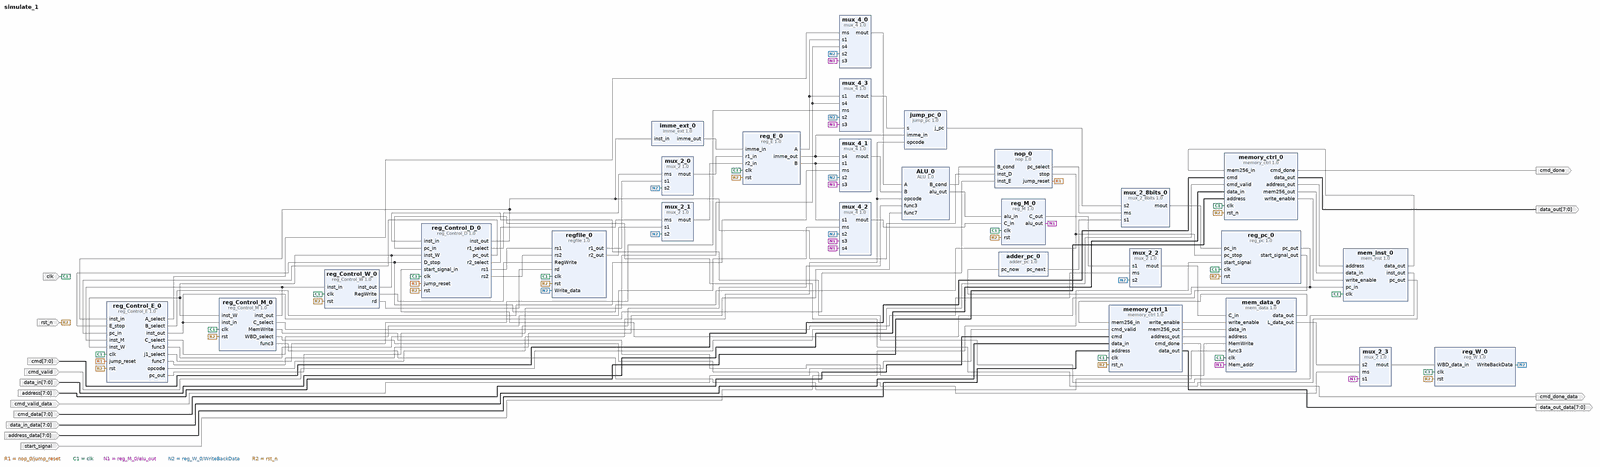
[diagram p0: block diagram of the top level, whole]
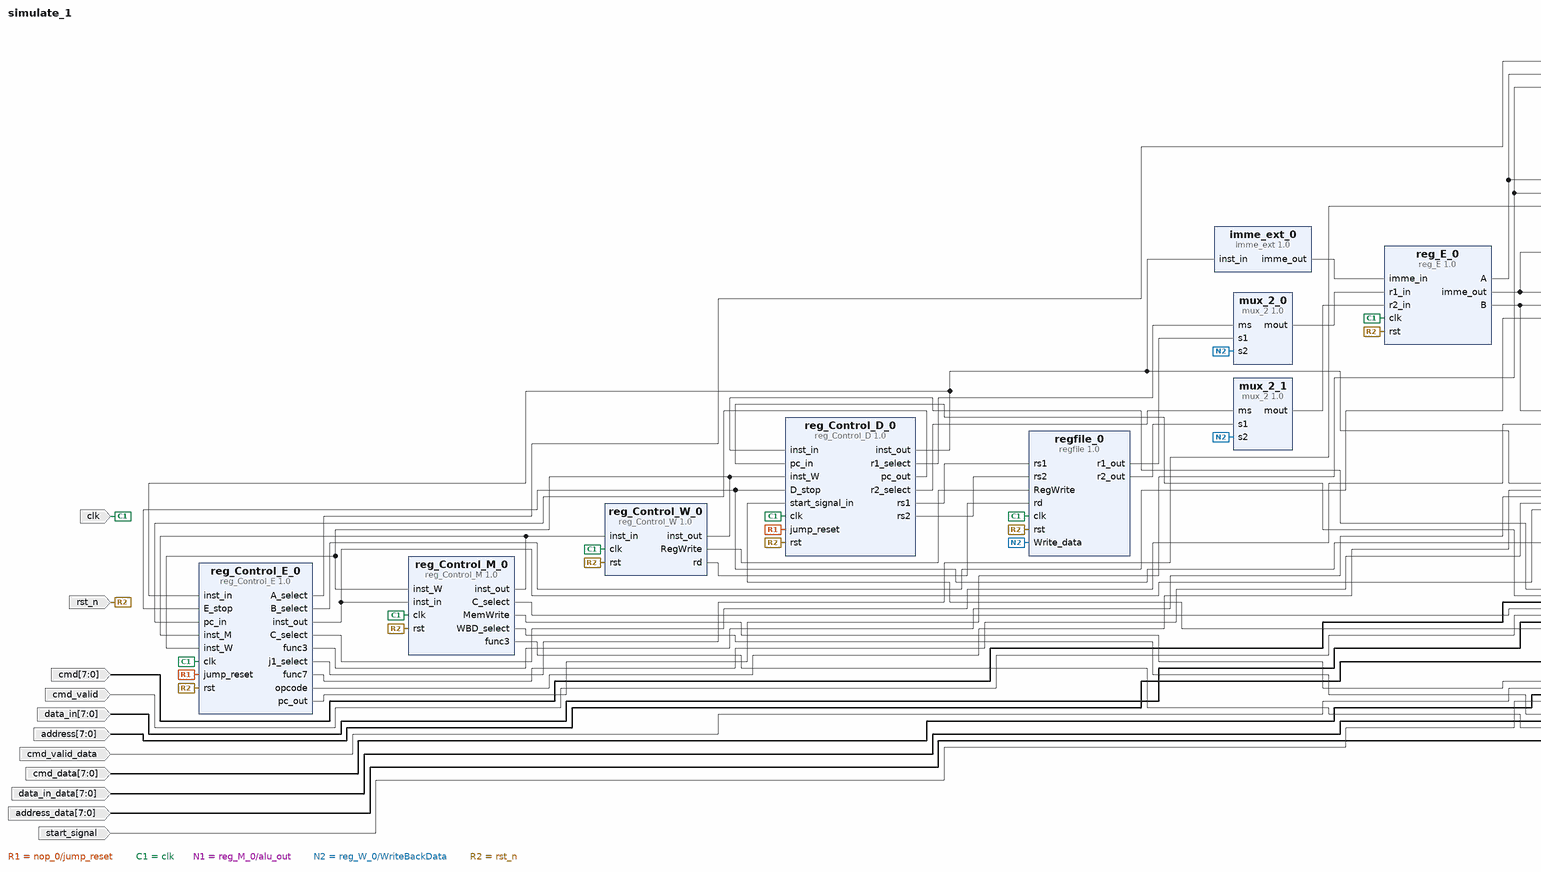
[diagram p1: block diagram of the top level, left part]
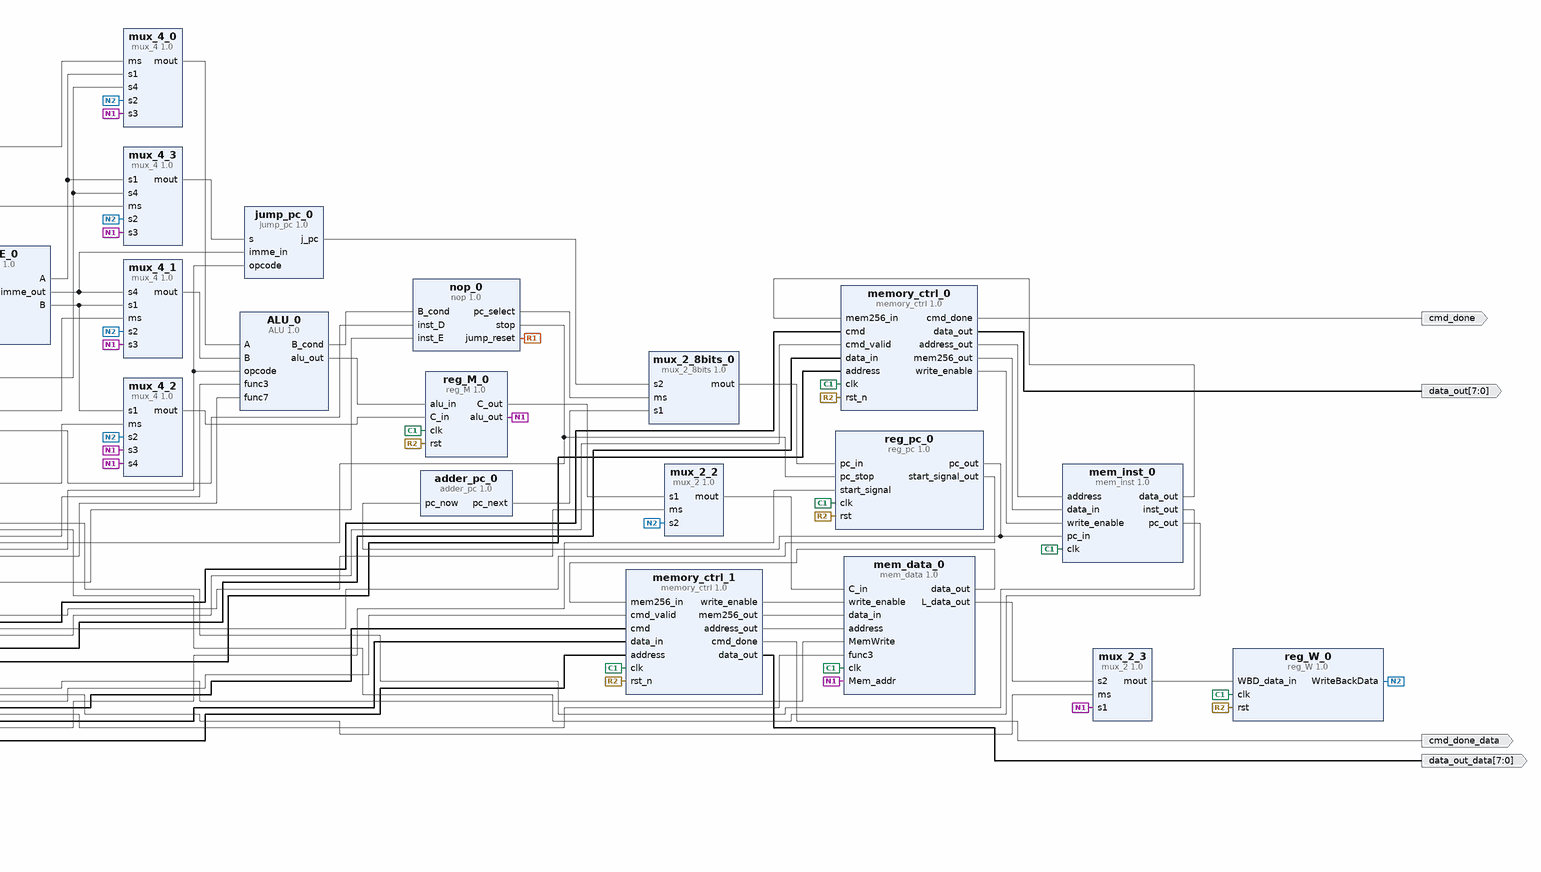
[diagram p2: block diagram of the top level, right part]
# Vivado block design simulate_1, xc7z020clg400-1, Vivado 2018.3
create_bd_design simulate_1

create_bd_port -dir I -type clk clk
create_bd_port -dir I -type rst rst_n
create_bd_port -dir I -from 7 -to 0 cmd
create_bd_port -dir I -from 7 -to 0 address
create_bd_port -dir I cmd_valid
create_bd_port -dir I -from 7 -to 0 data_in
create_bd_port -dir I cmd_valid_data
create_bd_port -dir I -from 7 -to 0 cmd_data
create_bd_port -dir I -from 7 -to 0 data_in_data
create_bd_port -dir I -from 7 -to 0 address_data
create_bd_port -dir I start_signal
create_bd_port -dir O cmd_done
create_bd_port -dir O -from 7 -to 0 data_out
create_bd_port -dir O cmd_done_data
create_bd_port -dir O -from 7 -to 0 data_out_data

create_bd_cell -type ip -vlnv xilinx.com:user:ALU:1.0 ALU_0
create_bd_cell -type ip -vlnv xilinx.com:user:adder_pc:1.0 adder_pc_0
create_bd_cell -type ip -vlnv xilinx.com:user:imme_ext:1.0 imme_ext_0
create_bd_cell -type ip -vlnv xilinx.com:user:jump_pc:1.0 jump_pc_0
create_bd_cell -type ip -vlnv xilinx.com:user:mem_data:1.0 mem_data_0
create_bd_cell -type ip -vlnv xilinx.com:user:mem_inst:1.0 mem_inst_0
create_bd_cell -type ip -vlnv xilinx.com:user:mux_2:1.0 mux_2_0
create_bd_cell -type ip -vlnv xilinx.com:user:mux_2:1.0 mux_2_1
create_bd_cell -type ip -vlnv xilinx.com:user:mux_2:1.0 mux_2_2
create_bd_cell -type ip -vlnv xilinx.com:user:mux_2:1.0 mux_2_3
create_bd_cell -type ip -vlnv xilinx.com:user:mux_2_8bits:1.0 mux_2_8bits_0
create_bd_cell -type ip -vlnv xilinx.com:user:mux_4:1.0 mux_4_0
create_bd_cell -type ip -vlnv xilinx.com:user:mux_4:1.0 mux_4_1
create_bd_cell -type ip -vlnv xilinx.com:user:mux_4:1.0 mux_4_2
create_bd_cell -type ip -vlnv xilinx.com:user:mux_4:1.0 mux_4_3
create_bd_cell -type ip -vlnv xilinx.com:user:nop:1.0 nop_0
create_bd_cell -type ip -vlnv xilinx.com:user:reg_Control_D:1.0 reg_Control_D_0
create_bd_cell -type ip -vlnv xilinx.com:user:reg_Control_E:1.0 reg_Control_E_0
create_bd_cell -type ip -vlnv xilinx.com:user:reg_Control_M:1.0 reg_Control_M_0
create_bd_cell -type ip -vlnv xilinx.com:user:reg_Control_W:1.0 reg_Control_W_0
create_bd_cell -type ip -vlnv xilinx.com:user:reg_E:1.0 reg_E_0
create_bd_cell -type ip -vlnv xilinx.com:user:reg_M:1.0 reg_M_0
create_bd_cell -type ip -vlnv xilinx.com:user:reg_W:1.0 reg_W_0
create_bd_cell -type ip -vlnv xilinx.com:user:reg_pc:1.0 reg_pc_0
create_bd_cell -type ip -vlnv xilinx.com:user:regfile:1.0 regfile_0
create_bd_cell -type ip -vlnv xilinx.com:user:memory_ctrl:1.0 memory_ctrl_0
create_bd_cell -type ip -vlnv xilinx.com:user:memory_ctrl:1.0 memory_ctrl_1

# ---- connections ----

connect_bd_net [get_bd_pins ALU_0/B_cond] [get_bd_pins nop_0/B_cond]
connect_bd_net [get_bd_pins ALU_0/alu_out] [get_bd_pins reg_M_0/alu_in]
connect_bd_net [get_bd_pins adder_pc_0/pc_next] [get_bd_pins mux_2_8bits_0/s1]
connect_bd_net [get_bd_pins imme_ext_0/imme_out] [get_bd_pins reg_E_0/imme_in]
connect_bd_net [get_bd_pins jump_pc_0/j_pc] [get_bd_pins mux_2_8bits_0/s2]
connect_bd_net [get_bd_pins mem_data_0/L_data_out] [get_bd_pins mux_2_3/s2]
connect_bd_net [get_bd_pins mem_inst_0/inst_out] [get_bd_pins reg_Control_D_0/inst_in]
connect_bd_net [get_bd_pins mem_inst_0/pc_out] [get_bd_pins reg_Control_D_0/pc_in]
connect_bd_net [get_bd_pins mux_2_0/mout] [get_bd_pins reg_E_0/r1_in]
connect_bd_net [get_bd_pins mux_2_1/mout] [get_bd_pins reg_E_0/r2_in]
connect_bd_net [get_bd_pins mux_2_2/mout] [get_bd_pins mem_data_0/C_in]
connect_bd_net [get_bd_pins mux_2_3/mout] [get_bd_pins reg_W_0/WBD_data_in]
connect_bd_net [get_bd_pins mux_2_8bits_0/mout] [get_bd_pins reg_pc_0/pc_in]
connect_bd_net [get_bd_pins mux_4_0/mout] [get_bd_pins ALU_0/A]
connect_bd_net [get_bd_pins mux_4_1/mout] [get_bd_pins ALU_0/B]
connect_bd_net [get_bd_pins mux_4_2/mout] [get_bd_pins reg_M_0/C_in]
connect_bd_net [get_bd_pins mux_4_3/mout] [get_bd_pins jump_pc_0/s]
connect_bd_net [get_bd_pins nop_0/jump_reset] [get_bd_pins reg_Control_D_0/jump_reset] [get_bd_pins reg_Control_E_0/jump_reset]
connect_bd_net [get_bd_pins nop_0/pc_select] [get_bd_pins mux_2_8bits_0/ms]
connect_bd_net [get_bd_pins nop_0/stop] [get_bd_pins reg_Control_D_0/D_stop] [get_bd_pins reg_pc_0/pc_stop] [get_bd_pins reg_Control_E_0/E_stop]
connect_bd_net -net processing_system7_0_FCLK_CLK0 [get_bd_ports clk] \
  [get_bd_pins reg_Control_D_0/clk] [get_bd_pins reg_pc_0/clk] [get_bd_pins mem_inst_0/clk] [get_bd_pins regfile_0/clk] \
  [get_bd_pins reg_E_0/clk] [get_bd_pins reg_Control_E_0/clk] [get_bd_pins reg_Control_M_0/clk] [get_bd_pins reg_M_0/clk] \
  [get_bd_pins mem_data_0/clk] [get_bd_pins reg_Control_W_0/clk] [get_bd_pins reg_W_0/clk] [get_bd_pins memory_ctrl_1/clk] \
  [get_bd_pins memory_ctrl_0/clk]
connect_bd_net [get_bd_pins reg_Control_D_0/inst_out] \
  [get_bd_pins nop_0/inst_D] [get_bd_pins imme_ext_0/inst_in] [get_bd_pins reg_Control_E_0/inst_in]
connect_bd_net [get_bd_pins reg_Control_D_0/pc_out] [get_bd_pins reg_Control_E_0/pc_in]
connect_bd_net [get_bd_pins reg_Control_D_0/r1_select] [get_bd_pins mux_2_0/ms]
connect_bd_net [get_bd_pins reg_Control_D_0/r2_select] [get_bd_pins mux_2_1/ms]
connect_bd_net [get_bd_pins reg_Control_D_0/rs1] [get_bd_pins regfile_0/rs1]
connect_bd_net [get_bd_pins reg_Control_D_0/rs2] [get_bd_pins regfile_0/rs2]
connect_bd_net [get_bd_pins reg_Control_E_0/A_select] [get_bd_pins mux_4_0/ms]
connect_bd_net [get_bd_pins reg_Control_E_0/B_select] [get_bd_pins mux_4_1/ms]
connect_bd_net [get_bd_pins reg_Control_E_0/C_select] [get_bd_pins mux_4_2/ms]
connect_bd_net [get_bd_pins reg_Control_E_0/func3] [get_bd_pins ALU_0/func3]
connect_bd_net [get_bd_pins reg_Control_E_0/func7] [get_bd_pins ALU_0/func7]
connect_bd_net [get_bd_pins reg_Control_E_0/inst_out] [get_bd_pins nop_0/inst_E] [get_bd_pins reg_Control_M_0/inst_in]
connect_bd_net [get_bd_pins reg_Control_E_0/j1_select] [get_bd_pins mux_4_3/ms]
connect_bd_net [get_bd_pins reg_Control_E_0/opcode] [get_bd_pins ALU_0/opcode] [get_bd_pins jump_pc_0/opcode]
connect_bd_net [get_bd_pins reg_Control_E_0/pc_out] [get_bd_pins mux_4_0/s4] [get_bd_pins mux_4_3/s4]
connect_bd_net [get_bd_pins reg_Control_M_0/C_select] [get_bd_pins mux_2_2/ms]
connect_bd_net [get_bd_pins reg_Control_M_0/MemWrite] [get_bd_pins mem_data_0/MemWrite]
connect_bd_net [get_bd_pins reg_Control_M_0/WBD_select] [get_bd_pins mux_2_3/ms]
connect_bd_net [get_bd_pins reg_Control_M_0/func3] [get_bd_pins mem_data_0/func3]
connect_bd_net [get_bd_pins reg_Control_M_0/inst_out] [get_bd_pins reg_Control_E_0/inst_M] [get_bd_pins reg_Control_W_0/inst_in]
connect_bd_net [get_bd_pins reg_Control_W_0/RegWrite] [get_bd_pins regfile_0/RegWrite]
connect_bd_net [get_bd_pins reg_Control_W_0/inst_out] \
  [get_bd_pins reg_Control_D_0/inst_W] [get_bd_pins reg_Control_E_0/inst_W] [get_bd_pins reg_Control_M_0/inst_W]
connect_bd_net [get_bd_pins reg_Control_W_0/rd] [get_bd_pins regfile_0/rd]
connect_bd_net [get_bd_pins reg_E_0/A] [get_bd_pins mux_4_0/s1] [get_bd_pins mux_4_3/s1]
connect_bd_net [get_bd_pins reg_E_0/B] [get_bd_pins mux_4_1/s1] [get_bd_pins mux_4_2/s1]
connect_bd_net [get_bd_pins reg_E_0/imme_out] [get_bd_pins mux_4_1/s4] [get_bd_pins jump_pc_0/imme_in]
connect_bd_net [get_bd_pins reg_M_0/C_out] [get_bd_pins mux_2_2/s1]
connect_bd_net [get_bd_pins reg_M_0/alu_out] \
  [get_bd_pins mux_4_1/s3] [get_bd_pins mux_4_0/s3] [get_bd_pins mux_4_2/s3] [get_bd_pins mux_4_3/s3] \
  [get_bd_pins mux_4_2/s4] [get_bd_pins mux_2_3/s1] [get_bd_pins mem_data_0/Mem_addr]
connect_bd_net [get_bd_pins reg_W_0/WriteBackData] \
  [get_bd_pins mux_2_0/s2] [get_bd_pins mux_2_1/s2] [get_bd_pins mux_4_0/s2] [get_bd_pins mux_4_1/s2] \
  [get_bd_pins mux_4_2/s2] [get_bd_pins mux_4_3/s2] [get_bd_pins mux_2_2/s2] [get_bd_pins regfile_0/Write_data]
connect_bd_net [get_bd_pins reg_pc_0/pc_out] [get_bd_pins mem_inst_0/pc_in] [get_bd_pins adder_pc_0/pc_now]
connect_bd_net [get_bd_pins reg_pc_0/start_signal_out] [get_bd_pins reg_Control_D_0/start_signal_in]
connect_bd_net [get_bd_pins regfile_0/r1_out] [get_bd_pins mux_2_0/s1]
connect_bd_net [get_bd_pins regfile_0/r2_out] [get_bd_pins mux_2_1/s1]
connect_bd_net [get_bd_ports rst_n] \
  [get_bd_pins memory_ctrl_1/rst_n] [get_bd_pins memory_ctrl_0/rst_n] [get_bd_pins reg_pc_0/rst] \
  [get_bd_pins reg_Control_D_0/rst] [get_bd_pins regfile_0/rst] [get_bd_pins reg_Control_E_0/rst] [get_bd_pins reg_E_0/rst] \
  [get_bd_pins reg_Control_M_0/rst] [get_bd_pins reg_M_0/rst] [get_bd_pins reg_Control_W_0/rst] [get_bd_pins reg_W_0/rst]
connect_bd_net [get_bd_ports cmd] [get_bd_pins memory_ctrl_0/cmd]
connect_bd_net [get_bd_ports cmd_valid] [get_bd_pins memory_ctrl_0/cmd_valid]
connect_bd_net [get_bd_ports data_in] [get_bd_pins memory_ctrl_0/data_in]
connect_bd_net [get_bd_ports address] [get_bd_pins memory_ctrl_0/address]
connect_bd_net [get_bd_ports cmd_valid_data] [get_bd_pins memory_ctrl_1/cmd_valid]
connect_bd_net [get_bd_ports cmd_data] [get_bd_pins memory_ctrl_1/cmd]
connect_bd_net [get_bd_ports data_in_data] [get_bd_pins memory_ctrl_1/data_in]
connect_bd_net [get_bd_ports address_data] [get_bd_pins memory_ctrl_1/address]
connect_bd_net [get_bd_pins memory_ctrl_1/write_enable] [get_bd_pins mem_data_0/write_enable]
connect_bd_net [get_bd_pins memory_ctrl_1/mem256_out] [get_bd_pins mem_data_0/data_in]
connect_bd_net [get_bd_pins memory_ctrl_1/address_out] [get_bd_pins mem_data_0/address]
connect_bd_net [get_bd_pins mem_data_0/data_out] [get_bd_pins memory_ctrl_1/mem256_in]
connect_bd_net [get_bd_pins mem_inst_0/data_out] [get_bd_pins memory_ctrl_0/mem256_in]
connect_bd_net [get_bd_pins memory_ctrl_0/address_out] [get_bd_pins mem_inst_0/address]
connect_bd_net [get_bd_pins memory_ctrl_0/mem256_out] [get_bd_pins mem_inst_0/data_in]
connect_bd_net [get_bd_pins memory_ctrl_0/write_enable] [get_bd_pins mem_inst_0/write_enable]
connect_bd_net [get_bd_pins memory_ctrl_0/cmd_done] [get_bd_ports cmd_done]
connect_bd_net [get_bd_pins memory_ctrl_0/data_out] [get_bd_ports data_out]
connect_bd_net [get_bd_pins memory_ctrl_1/cmd_done] [get_bd_ports cmd_done_data]
connect_bd_net [get_bd_pins memory_ctrl_1/data_out] [get_bd_ports data_out_data]
connect_bd_net [get_bd_ports start_signal] [get_bd_pins reg_pc_0/start_signal]

validate_bd_design
save_bd_design
